# EAGLE schematic XOR (EAGLE 7.4.0)
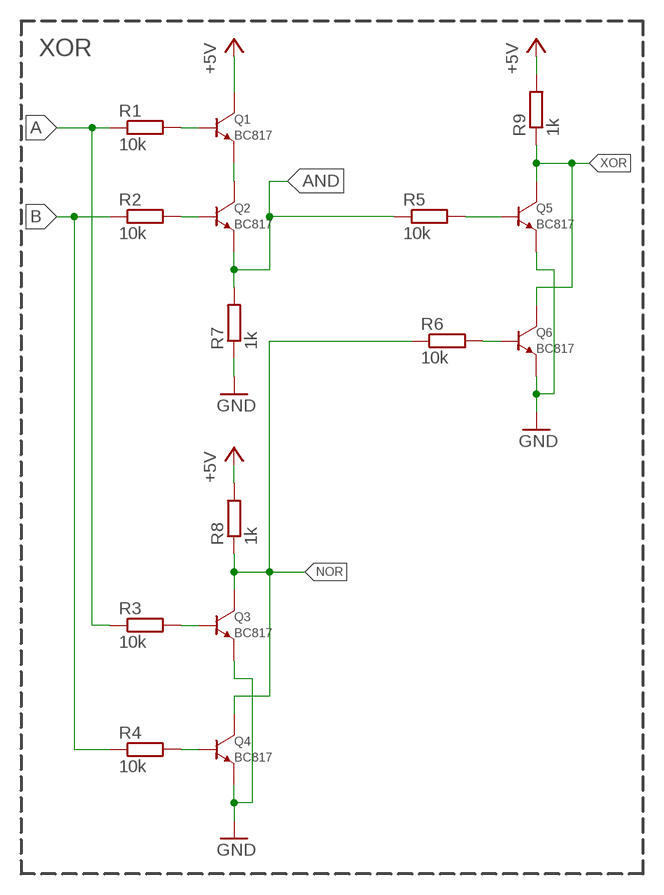
[diagram p0: schematic, sheet 1]

## Parts
Q1  BC817  TRANSISTOR-NPN-GENERICDEFAULT-SOT23-BEC  [SOT23]
Q2  BC817  TRANSISTOR-NPN-GENERICDEFAULT-SOT23-BEC  [SOT23]
Q3  BC817  TRANSISTOR-NPN-GENERICDEFAULT-SOT23-BEC  [SOT23]
Q4  BC817  TRANSISTOR-NPN-GENERICDEFAULT-SOT23-BEC  [SOT23]
Q5  BC817  TRANSISTOR-NPN-GENERICDEFAULT-SOT23-BEC  [SOT23]
Q6  BC817  TRANSISTOR-NPN-GENERICDEFAULT-SOT23-BEC  [SOT23]
R1  10k  R-EU_R0805  [R0805]
R2  10k  R-EU_R0805  [R0805]
R3  10k  R-EU_R0805  [R0805]
R4  10k  R-EU_R0805  [R0805]
R5  10k  R-EU_R0805  [R0805]
R6  10k  R-EU_R0805  [R0805]
R7  1k  R-EU_R0805  [R0805]
R8  1k  R-EU_R0805  [R0805]
R9  1k  R-EU_R0805  [R0805]

## Nets
+5V: Q1.P$3(COLLECTOR) R8.2 R9.2
A: R1.1 R3.1
AND: Q2.P$2(EMITTER) R5.1 R7.2
B: R2.1 R4.1
GND: Q3.P$2(EMITTER) Q4.P$2(EMITTER) Q5.P$2(EMITTER) Q6.P$2(EMITTER) R7.1
N$19: Q1.P$2(EMITTER) Q2.P$3(COLLECTOR)
N$21: Q1.P$1(BASE) R1.2
N$22: Q2.P$1(BASE) R2.2
N$23: Q4.P$1(BASE) R4.2
N$24: Q3.P$1(BASE) R3.2
N$25: Q6.P$1(BASE) R6.2
N$26: Q5.P$1(BASE) R5.2
NOR: Q3.P$3(COLLECTOR) Q4.P$3(COLLECTOR) R6.1 R8.1
XOR: Q5.P$3(COLLECTOR) Q6.P$3(COLLECTOR) R9.1

## Notes on the sheet
- XOR

## Library data of the parts
Q1-Q6 = p.peter-scoville.tests:TRANSISTOR-NPN-GENERIC; SV_SPICE_MODEL: NPN (); SV_SPICE_ORDER: COLLECTOR;BASE;EMITTER; SV_SPICE_PREFIX: Q
R1-R9 = p.peter-scoville.tests:R-EU_: RESISTOR, European symbol; SV_SPICE_ORDER: 1;2; SV_SPICE_PREFIX: R